# Altium project ft232h.PrjPcb
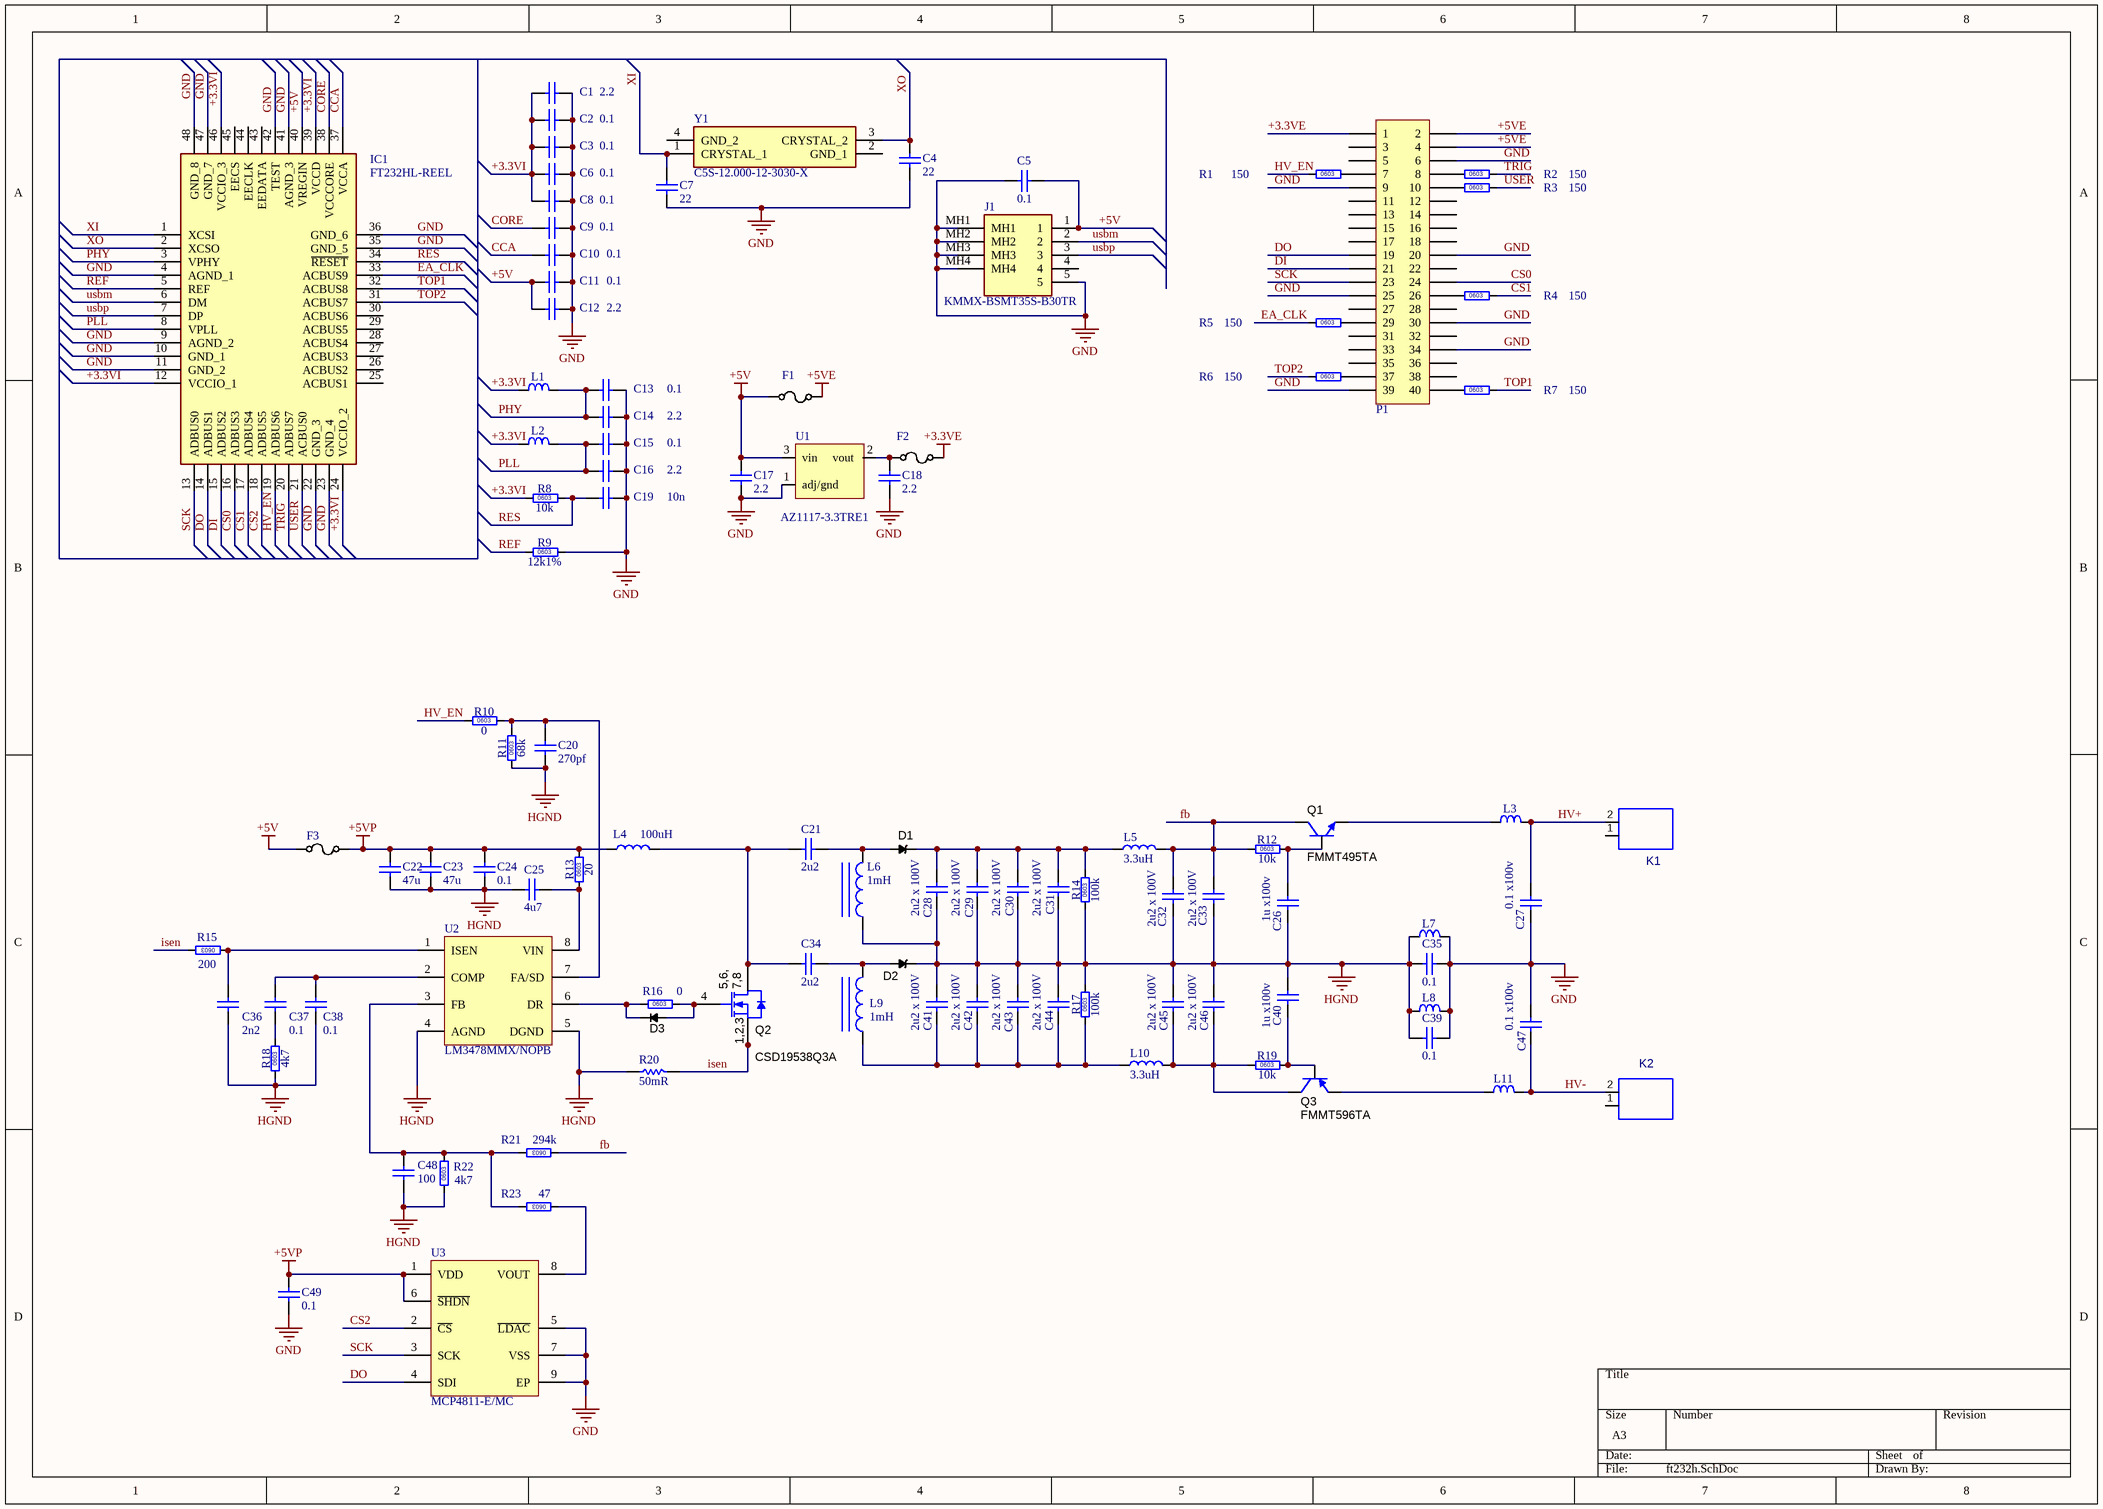
[diagram p0: ft232h.SchDoc]
1 sheet, 101 parts. Net scope: global (net labels, ports and power ports of the same name join across sheets).
Board file: ft232h.PcbDoc

## Sheet ft232h.SchDoc
size A3

### Parts
C1  value 2.2  [SM0603 _3D_cap]  (hidden comment: cap0603)
C2  value 0.1  [SM0603 _3D_cap]  (hidden comment: cap0603)
C3  value 0.1  [SM0603 _3D_cap]  (hidden comment: cap0603)
C4  value 22  [SM0603 _3D_cap]  (hidden comment: cap0603)
C5  value 0.1  [SM0603 _3D_cap]  (hidden comment: cap0603)
C6  value 0.1  [SM0603 _3D_cap]  (hidden comment: cap0603)
C7  value 22  [SM0603 _3D_cap]  (hidden comment: cap0603)
C8  value 0.1  [SM0603 _3D_cap]  (hidden comment: cap0603)
C9  value 0.1  [SM0603 _3D_cap]  (hidden comment: cap0603)
C10  value 0.1  [SM0603 _3D_cap]  (hidden comment: cap0603)
C11  value 0.1  [SM0603 _3D_cap]  (hidden comment: cap0603)
C12  value 2.2  [SM0603 _3D_cap]  (hidden comment: cap0603)
C13  value 0.1  [SM0603 _3D_cap]  (hidden comment: cap0603)
C14  value 2.2  [SM0603 _3D_cap]  (hidden comment: cap0603)
C15  value 0.1  [SM0603 _3D_cap]  (hidden comment: cap0603)
C16  value 2.2  [SM0603 _3D_cap]  (hidden comment: cap0603)
C17  value 2.2  [SM0603 _3D_cap]  (hidden comment: cap0603)
C18  value 2.2  [SM0603 _3D_cap]  (hidden comment: cap0603)
C19  value 10n  [SM0603 _3D_cap]  (hidden comment: cap0603)
C20  value 270pf  [SM0603 _3D_cap]  (hidden comment: cap0603)
C21  value 2u2  [SM0603 _3D_cap]  (hidden comment: cap0603)
C22  value 47u  [SM0805]  (hidden comment: cap0805)
C23  value 47u  [SM0805]  (hidden comment: cap0805)
C24  value 0.1  [SM0603 _3D_cap]  (hidden comment: cap0603)
C25  value 4u7  [SM0603 _3D_cap]  (hidden comment: cap0603)
C26  value 1u x100v  [SM0603 _3D_cap]  (hidden comment: cap0603)
C27  value 0.1 x100v  [SM0603 _3D_cap]  (hidden comment: cap0603)
C28  value 2u2 x 100V  [SM1206]  (hidden comment: cap1206)
C29  value 2u2 x 100V  [SM1206]  (hidden comment: cap1206)
C30  value 2u2 x 100V  [SM1206]  (hidden comment: cap1206)
C31  value 2u2 x 100V  [SM1206]  (hidden comment: cap1206)
C32  value 2u2 x 100V  [SM1206]  (hidden comment: cap1206)
C33  value 2u2 x 100V  [SM1206]  (hidden comment: cap1206)
C34  value 2u2  [SM0603 _3D_cap]  (hidden comment: cap0603)
C35  value 0.1  [SM0603 _3D_cap]  (hidden comment: cap0603)
C36  value 2n2  [SM0603 _3D_cap]  (hidden comment: cap0603)
C37  value 0.1  [SM0603 _3D_cap]  (hidden comment: cap0603)
C38  value 0.1  [SM0603 _3D_cap]  (hidden comment: cap0603)
C39  value 0.1  [SM0603 _3D_cap]  (hidden comment: cap0603)
C40  value 1u x100v  [SM0603 _3D_cap]  (hidden comment: cap0603)
C41  value 2u2 x 100V  [SM1206]  (hidden comment: cap1206)
C42  value 2u2 x 100V  [SM1206]  (hidden comment: cap1206)
C43  value 2u2 x 100V  [SM1206]  (hidden comment: cap1206)
C44  value 2u2 x 100V  [SM1206]  (hidden comment: cap1206)
C45  value 2u2 x 100V  [SM1206]  (hidden comment: cap1206)
C46  value 2u2 x 100V  [SM1206]  (hidden comment: cap1206)
C47  value 0.1 x100v  [SM0603 _3D_cap]  (hidden comment: cap0603)
C48  value 100  [SM0603 _3D_cap]  (hidden comment: cap0603)
C49  value 0.1  [SM0603 _3D_cap]  (hidden comment: cap0603)
D1  STPS1150A  [SMA]  (value not drawn)
D2  STPS1150A  [SMA]  (value not drawn)
D3  1N4148X-TP  [SOD-523]  (value not drawn)
F1  Fuse_0805  [MF-PSMF050X-2]  (value not drawn)
F2  Fuse_0805  [MF-PSMF050X-2]  (value not drawn)
F3  Fuse_0805  [MF-PSMF050X-2]  (value not drawn)
IC1  FT232HL-REEL  [QFP50P900X900X160-48N]
J1  KMMX-BSMT35S-B30TR  [KMMXBSMT35SB30TR]
K1  1x2PLS  [JUMPER2]  (value not drawn)
K2  1x2PLS  [JUMPER2]  (value not drawn)
L1  75R@100MHz  [SM0603_3D_res]  (value not drawn)
L2  75R@100MHz  [SM0603_3D_res]  (value not drawn)
L3  75R@100MHz  [SM0603_3D_res]  (value not drawn)
L4  100uH  [WE-LQS_8040]
L5  3.3uH  [WE 74479775233]
L6  1mH  [WE-TPC_4828]
L7  75R@100MHz  [SM0603_3D_res]  (value not drawn)
L8  75R@100MHz  [SM0603_3D_res]  (value not drawn)
L9  1mH  [WE-TPC_4828]
L10  3.3uH  [WE 74479775233]
L11  75R@100MHz  [SM0603_3D_res]  (value not drawn)
P1  2x20 2.54mm vertical  [PLD-40]  (value not drawn)
Q1  FMMT495TA  [SOT-23-3]
Q2  CSD19538Q3A  [DNH0008A]
Q3  FMMT596TA  [SOT-23-3]
R1  150  [SM0603_3D_res]
R2  150  [SM0603_3D_res]
R3  150  [SM0603_3D_res]
R4  150  [SM0603_3D_res]
R5  150  [SM0603_3D_res]
R6  150  [SM0603_3D_res]
R7  150  [SM0603_3D_res]
R8  10k  [SM0603_3D_res]
R9  12k1%  [SM0603_3D_res]
R10  0  [SM0603_3D_res]
R11  68k  [SM0603_3D_res]
R12  10k  [SM0603_3D_res]
R13  20  [SM0603_3D_res]
R14  100k  [SM0603_3D_res]
R15  200  [SM0603_3D_res]
R16  0  [SM0603_3D_res]
R17  100k  [SM0603_3D_res]
R18  4k7  [SM0603_3D_res]
R19  10k  [SM0603_3D_res]
R20  50mR  [RES 2010/5025]
R21  294k  [SM0603_3D_res]
R22  4k7  [SM0603_3D_res]
R23  47  [SM0603_3D_res]
U1  ldo  [SOT89-150P409X160-3N]  (value not drawn)
U2  LM3478MMX/NOPB  [MSOP8]
U3  MCP4811-E/MC  [DFN-8]
Y1  C5S-12.000-12-3030-X  [C5S]

### Nets
+3.3VE: F2.2 P1.1
+5V: C5.1 C11.2 C12.2 C17.2 F1.1 F3.1 IC1.40(VREGIN) J1.1 U1.3(vin)
+5VE: F1.2 P1.2 P1.4
+5VP: C22.2 C23.2 C24.2 C49.1 F3.2 L4.1 R13.2 U3.1(VDD) U3.6(~{SHDN})
GND: C1.1 C2.1 C3.1 C4.1 C5.2 C6.1 C7.1 C8.1 C9.1 C10.1 C11.1 C12.1 C13.1 C14.1 C15.1 C16.1 C17.1 C18.1 C19.1 C27.1 C35.2 C39.2 C47.2 C49.2 IC1.4(AGND_1) IC1.9(AGND_2) IC1.10(GND_1) IC1.11(GND_2) IC1.22(GND_3) IC1.23(GND_4) IC1.35(GND_5) IC1.36(GND_6) IC1.41(AGND_3) IC1.42(TEST) IC1.47(GND_7) IC1.48(GND_8) J1.5 J1.MH1 J1.MH2 J1.MH3 J1.MH4 L7.2 L8.2 P1.6 P1.9 P1.20 P1.25 P1.30 P1.34 P1.39 R9.2 U1.1(adj/gnd) U3.5(~{LDAC}) U3.7(VSS) U3.9(EP)
HGND: C20.2 C22.1 C23.1 C24.1 C25.1 C26.1 C28.1 C29.1 C30.1 C31.1 C32.1 C33.1 C35.1 C36.2 C38.2 C39.1 C40.2 C41.2 C42.2 C43.2 C44.2 C45.2 C46.2 C48.2 D2.1(K) L6.1 L7.1 L8.1 R11.1 R14.1 R17.2 R18.1 R20.1 R22.1 U2.4(AGND) U2.5(DGND)
+3.3VI: C1.2 C2.2 C3.2 C6.2 C8.2 IC1.12(VCCIO_1) IC1.24(VCCIO_2) IC1.39(VCCD) IC1.46(VCCIO_3) L1.1 L2.1 R8.1
CCA: C10.2 IC1.37(VCCA)
CORE: C9.2 IC1.38(VCCCORE)
CS0: IC1.16(ADBUS3) P1.24
CS1: IC1.17(ADBUS4) R4.2
CS2: IC1.18(ADBUS5) U3.2(~{CS})
DI: IC1.15(ADBUS2) P1.21
DO: IC1.14(ADBUS1) P1.19 U3.4(SDI)
EA_CLK: IC1.33(ACBUS9) R5.1
fb: C32.2 C33.2 L5.2 Q1.3(C) R12.1 R21.1
HV+: C27.2 K1.2 L3.2
HV-: C47.1 K2.2 L11.2
HV_EN: IC1.19(ADBUS6) R1.1 R10.1
isen: Q2.1(S) Q2.2(S) Q2.3(S) R15.2 R20.2
PHY: C13.2 C14.2 IC1.3(VPHY) L1.2
PLL: C15.2 C16.2 IC1.8(VPLL) L2.2
REF: IC1.5(REF) R9.1
RES: C19.2 IC1.34(~{RESET}) R8.2
SCK: IC1.13(ADBUS0) P1.23 U3.3(SCK)
TOP1: IC1.32(ACBUS8) R7.2
TOP2: IC1.31(ACBUS7) R6.1
TRIG: IC1.20(ADBUS7) R2.2
usbm: IC1.6(DM) J1.2
usbp: IC1.7(DP) J1.3
USER: IC1.21(ACBUS0) R3.2
XI: C7.2 IC1.1(XCSI) Y1.1(CRYSTAL_1)
XO: C4.2 IC1.2(XCSO) Y1.3(CRYSTAL_2)
NetC18_2: C18.2 F2.1 U1.2(vout)
NetC20_1: C20.1 R10.2 R11.2 U2.7(FA/SD)
NetC21_1: C21.1 C34.1 L4.2 Q2.5(D) Q2.6(D) Q2.7(D) Q2.8(D) Q2.9(D)
NetC21_2: C21.2 D1.2(A) L6.2
NetC25_2: C25.2 R13.1 U2.8(VIN)
NetC26_2: C26.2 Q1.1(B) R12.2
NetC28_2: C28.2 C29.2 C30.2 C31.2 D1.1(K) L5.1 R14.2
NetC34_2: C34.2 D2.2(A) L9.2
NetC36_1: C36.1 R15.1 U2.1(ISEN)
NetC37_1: C37.1 C38.1 U2.2(COMP)
NetC37_2: C37.2 R18.2
NetC40_1: C40.1 Q3.1(B) R19.2
NetC41_1: C41.1 C42.1 C43.1 C44.1 L9.1 L10.1 R17.1
NetC45_1: C45.1 C46.1 L10.2 Q3.3(C) R19.1
NetC48_1: C48.1 R21.2 R22.2 R23.2 U2.3(FB)
NetD3_1: D3.1(K) R16.1 U2.6(DR)
NetD3_2: D3.2(A) Q2.4(G) R16.2
NetL3_1: L3.1 Q1.2(E)
NetL11_1: L11.1 Q3.2(E)
NetP1_7: P1.7 R1.2
NetP1_8: P1.8 R2.1
NetP1_10: P1.10 R3.1
NetP1_26: P1.26 R4.1
NetP1_29: P1.29 R5.2
NetP1_37: P1.37 R6.2
NetP1_40: P1.40 R7.1
NetR23_1: R23.1 U3.8(VOUT)

Not connected (* = marked no-connect by the designer): IC1 25(ACBUS1) 26(ACBUS2) 27(ACBUS3) 28(ACBUS4) 29(ACBUS5) 30(ACBUS6) 43(EEDATA) 44(EECLK) 45(EECS); J1 4; K1 1; K2 1; P1 3 5 11 12 13 14 15 16 17 18 22 27 28 31 32 33 35 36 38; Y1 2(GND_1) 4(GND_2)

### Notes on the sheet
- (in symbol CSD19538Q3A) 5,6,; 7,8; 1,2,3
- (in symbol LM1117-XX-SOT89-3) AZ1117-3.3TRE1
- (in symbol Res_0603_EU) 0603

### Library data of the parts
C1-C21 C24-C27 C34-C40 C47-C49 = cap0603: Capacitor  0603 inch; Published: 8-Jun-2000; LatestRevisionDate: 17-Jul-2002; LatestRevisionNote: Re-released for DXP Platform.; PackageReference: RAD-0.3; Publisher: Altium Limited; PackageDescription: Radial Cap, Thru-Hole; 2 Leads; 0.3 in Pin Spacing
C22 C23 = cap0805: Capacitor; Published: 8-Jun-2000; LatestRevisionDate: 17-Jul-2002; LatestRevisionNote: Re-released for DXP Platform.; PackageReference: RAD-0.3; Publisher: Altium Limited; PackageDescription: Radial Cap, Thru-Hole; 2 Leads; 0.3 in Pin Spacing
C28-C33 C41-C46 = cap1206: Capacitor; Published: 8-Jun-2000; LatestRevisionDate: 17-Jul-2002; LatestRevisionNote: Re-released for DXP Platform.; PackageReference: RAD-0.3; Publisher: Altium Limited; PackageDescription: Radial Cap, Thru-Hole; 2 Leads; 0.3 in Pin Spacing
D1 D2 = STPS1150A: DIODE SCHOTTKY 150V 1A SMA; Manufacturer: STMicroelectronics; U/M: EA; Vf_V: 0.78; Value2: 0.78V; Io_A: 1; Vr_V: 150; TJmax_C: 175; RJC_CperW: 30; SizeAreaWB_mm2: 37.3428; SizeArea_mm2: 16.3228; SizeX_mm: 5.59; SizeY_mm: 2.92; SizeZ_mm: 2.87; AEC Category: Q101; AEC Qualified: N; Green_Lifecycle: Not Set; Green_REACh: Incomplete; CompType: Diode; SymbolVersion: 2008-12-08; PartNumber: STPS1150A; PackageReference: SMA; Value: 150V; Value1: 1A; MountType: SMT; Type: Schottky; RoHS: Y; Published: 2008-06-26; Publisher: Texas Instruments; LatestRevisionDate: 2017-06-26; ComponentLink1Description: Datasheet link; ComponentLink1URL: http://www.st.com/web/en/resource/technical/document/datasheet/CD00003321.pdf; Supplier 1: Digi-Key; Supplier Part Number 1: 497-7545-1-ND; Supplier 2: Newark; Supplier Part Number 2: 57P1608; Supplier 3: Mouser; Supplier Part Number 3: 511-STPS1150A; Green_EU RoHS: Incomplete; Green_EU RoHS-2: Incomplete
D3 = 1N4148X-TP: DIODE SWITCHING 75V 0.3A SOD-523; Manufacturer: Micro Commercial Components; U/M: EA; Vf_V: 1.25; Value2: 1.25V; Io_A: 0.3; Vr_V: 75; TJmax_C: 150; SizeAreaWB_mm2: 5.13; SizeArea_mm2: 1.53; SizeX_mm: 1.7; SizeY_mm: 0.9; SizeZ_mm: 0.65; AEC Category: Q101; Green_Lifecycle: Not Set; Green_REACh: Incomplete; SymbolVersion: 2008-12-08; PartNumber: 1N4148X-TP; PackageReference: SOD-523; CompType: Diode; Value: 75V; Value1: 0.3A; MountType: SMT; Type: Switching; RoHS: Y; Published: 2008-06-26; Publisher: Texas Instruments; LatestRevisionDate: 2017-06-26; ComponentLink1Description: Datasheet link; ComponentLink1URL: http://www.mccsemi.com/up_pdf/1N4148X(SOD-523).PDF; Supplier 1: Digi-Key; Supplier Part Number 1: 1N4148XTPMSCT-ND; Supplier 2: Newark; Supplier Part Number 2: 69R6666; Supplier 3: Mouser; Supplier Part Number 3: 833-1N4148X-TP; AEC Qualified: ?; Green_EU RoHS: Incomplete; Green_EU RoHS-2: Incomplete
F1-F3 = Fuse_0805: FUSE 0805 RESETTABLE PTC 6V 500MA; Manufacturer: BOURNS; Thermistor Mounting: SMD; Product Range: MF-PSMF Series; Holding Current: 500; Tripping Current: 1; Voltage Rating: 6; SVHC: No SVHC (20-Jun-2016); Carrying Current Max: 40; Current Temperature: 20; External Depth: 1.35; External Length / Height: 0.65; External Width: 2.15; Holding Current Max Ih: 0.5; Initial Resistance Max: 0.9; Initial Resistance Min: 0.15; PTC Fuse Case Style: 0805 [2012 Metric]; Thermistor Type: PTC Resettable Fuse; Trip Time: 0.1; Supplier 1: Farnell; Manufacturer Part Number: MF-PSMF050X-2; RoHS: YES; Stock 1: 28; Pricing 1: 5=0.229, 50=0.205, 250=0.173, 500=0.137, 1500=0.136, 3000=0.134, 15000=0.133 (GBP); Operating Temperature Min: -40; Operating Temperature Max: 85; Automotive Qualification Standard: -; Current Max: 40; Operating Voltage: 6; Packaging: Cut Tape; Resistance @ Temperature: 0.15; Resistance Temperature: 20; Termination Type: Surface Mount Device; ComponentLink1URL: http://www.bourns.com/engineering/mfpsmf/mf-psmf050x.stp; ComponentLink1Description: http://www.bourns.com/engineering/mfpsmf/mf-psmf050x.stp; ComponentLink2URL: http://www.youtube.com/embed/MCSq9aHzU7o; ComponentLink2Description: http://www.youtube.com/embed/MCSq9aHzU7o; ComponentLink3URL: http://www.farnell.com/datasheets/2041417.pdf; ComponentLink3Description: http://www.farnell.com/datasheets/2041417.pdf
IC1 = FT232HL-REEL: Integrated Circuit; Manufacturer_Name: FTDI Chip; Datasheet Link: http://www.ftdichip.com/Support/Documents/DataSheets/ICs/DS_FT232H.pdf; Height: 1.6mm; Manufacturer_Part_Number: FT232HL-REEL; Mouser Part Number: 895-FT232HL-REEL; Mouser Price/Stock: https://www.mouser.co.uk/ProductDetail/FTDI/FT232HL-REEL/?qs=rzPzygjq8vIanTFlYsBQCw%3D%3D; Arrow Part Number: FT232HL-REEL; Arrow Price/Stock: https://www.arrow.com/en/products/ft232hl-reel/ftdi-chip
J1 = KMMX-BSMT35S-B30TR: Connector; Manufacturer_Name: Kycon; Datasheet Link: http://www.kycon.com/Pub_Eng_Draw/KMMX-BSMT35S-BTR.pdf; Height: 2.18mm; Manufacturer_Part_Number: KMMX-BSMT35S-B30TR
L1-L3 L7 L8 L11 = chip inductance 0603: Part Number: IND0805_MURATA_BLM21BB750SN1D; Part Description: SMD EMIFIL Suppression Chip Ferrite Bead; Manufacturer: MURATA; Manufacturer Part Number: BLM21BB750SN1D; Power: 700mA; Resistance: 0.16R; Tolerance: ±25%; Table: Inductors SMD; Component Kind: Standard; Component Type: Standard; Footprint: INDC2012X105N; Pin Count: 2; Value: 75R@100MHz; Status: None; Case: 0805; Mounted: Yes; Socket: No; SMD: Yes; ComponentHeight: 1.05mm; Author: S. Jafar; CreateDate: 12/21/2015; LatestRevisionDate: 12/21/2015
L4 = inductance_8040: INDUCTOR 100uH 8040 1A 290mOhm; Manufacturer: Wurth Electronics; Manufacturer Part Number: 74404084101; Core Material: Ferrite; Inductance Tolerance: 20%; Current Rating: 1.2A; Saturation Current: 1.5A; Shielding: Shielded; DC Resistance (DCR): 290mR; Self Resonant Frequency: 6.4MHz; Test Frequency: 100kHz; Supplier 1: Farnell; Stock 1: 0; Pricing 1: 10=1.38, 50=0.922, 100=0.891, 250=0.859, 500=0.746, 1000=0.633, 5000=0.62 (EUR); Mount: Surface Mount; Case/Package: Nonstandard; Min Operating Temperature: -40°C; Max Operating Temperature: 125°C; Packaging: Tape and Reel; Resistor Type: Wirewound; Inductance: 100uH; RMS Current (Irms): 1A; Tolerance: 20%; Termination: SMD/SMT; Max DC Current: 1A; Package Quantity: 1000; Length: 0.315inch; Width: 0.315inch; Height: 4.2mm; Height - Seated (Max): 0.165inch; REACH SVHC: Unknown; RoHS Compliant: Yes; ComponentLink1URL: http://www.farnell.com/datasheets/1832943.pdf?src-supplier=Element14; ComponentLink1Description: http://www.farnell.com/datasheets/1832943.pdf?src-supplier=Element14
L5 L10 = Inductor_0805: INDUCTOR 3.3uH 0805 ±20%  1A; Manufacturer: Wurth Electronics; Manufacturer Part Number: 74479775233; Saturation Current: 280mA; Shielding: Unshielded; DC Resistance (DCR): 200mR; Self Resonant Frequency: 30MHz; Test Frequency: 1MHz; Supplier 1: Farnell; Stock 1: 0; Pricing 1: 10=0.739, 50=0.517, 250=0.446, 500=0.41, 1500=0.404, 3000=0.398, 15000=0.39 (EUR); Mount: Surface Mount; Case/Package: SMD/SMT; Case Code (Metric): 2012; Case Code (Imperial): 0805; Min Operating Temperature: -40°C; Max Operating Temperature: 125°C; Packaging: Tape and Reel; Inductance: 3.3uH; Current Rating: 1A; Tolerance: 20%; Length: 0.079inch; Width: 0.047inch; Height - Seated (Max): 0.039inch; RoHS Compliant: Yes
L6 L9 = inductor_4828: INDUCTOR 1mH ±30% 140mA; Manufacturer: Wurth Electronics; Manufacturer Part Number: 744043102; Supplier 1: RSComponents; Stock 1: 0; Pricing 1: 500=0.747 (EUR); RoHS Compliant: Yes; Inductance: 1mH
P1 = 2x20 2.54mm vertical: Header, 40-Pin; LatestRevisionDate: 17-Jul-2002; LatestRevisionNote: Re-released for DXP Platform.; Publisher: Altium Limited
Q1 = FMMT495TA: TRANSISTOR NPN 150V 1A AEC-Q101 SOT-23; Manufacturer: Diodes Inc.; TaMin_C: -55°C; HfeMax: 300.0; SizeAreaWB_mm2: 14.0; U/M: EA; TaMax_C: 150°C; SizeZ_mm: 1.1; SizeX_mm: 2.5; SizeY_mm: 3.0; SizeArea_mm2: 7.5; CompType: BJT; PNP: 0.0; AEC Qualified: Y; NPN: 1.0; Vcesat1_V: 3dV; AEC Category: Q101; ComponentLink1URL: https://www.diodes.com/assets/Datasheets/FMMT495.pdf; Supplier Part Number 2: 522-FMMT495TA; Publisher: Texas Instruments; Supplier 2: Mouser; Published: 2008-07-31; RoHS: Y; Value1: 1 A; MountType: SMT; Vceo_V: 150V; Value: 150 V; Supplier 1: Digi-Key; IcRated_A: 1A; PackageReference: SOT-23; Value2: 300.0; PartNumber: FMMT495TA; LatestRevisionDate: 2017-06-26; ComponentLink1Description: Datasheet link; Supplier Part Number 1: FMMT495CT-ND
Q2 = CSD19538Q3A: MOSFET N 100V 5A; Alternate Manufacturer: None; Manufacturer: Texas Instruments; SizeZ_mm: 0.9; Value2: 7.2 nC; SizeX_mm: 3.3; SizeAreaWB_mm2: 18.49; Vgs_V: 20V; QgTyp_nC: 7.2; SizeArea_mm2: 10.89; AEC Category: Q101; ChMode: Enhancement; ChType: N; PartNumber: CSD19538Q3A; ComponentLink1Description: Datasheet link; VdsMax_V: 100V; SizeY_mm: 3.3; CompType: MOSFET; AEC Qualified: N; Value: 100V; RoHS: Y; IdsMax_A: 5A; PackageReference: DNH0008A; MountType: SMT; ComponentLink1URL: http://www.ti.com/lit/ds/symlink/csd19538q3a.pdf
Q3 = FMMT596TA: TRANSISTOR PNP 200V 0.3A SOT-23; Manufacturer: Diodes Inc.; TaMax_C: 150°C; Value2: 300; Vcesat1_V: 2dV; SizeX_mm: 2.5; SizeY_mm: 3; TaMin_C: -55°C; IcRated_A: 3dA; CompType: BJT; SizeZ_mm: 1.1; AEC Qualified: N; SizeArea_mm2: 7.5; NPN: 0; PNP: 1; AEC Category: Q101; SizeAreaWB_mm2: 14; U/M: EA; Supplier 2: Mouser; Supplier 1: Digi-Key; Supplier Part Number 1: FMMT596CT-ND; Supplier Part Number 2: 522-FMMT596TA; Value1: 0.3 A; PartNumber: FMMT596TA; LatestRevisionDate: 2017-03-09; Publisher: Texas Instruments; ComponentLink1Description: Datasheet link; HfeMax: 300; Value: 200 V; Published: 2008-07-31; RoHS: Y; Vceo_V: 200V; PackageReference: SOT-23; MountType: SMT; ComponentLink1URL: http://www.diodes.com/_files/datasheets/FMMT596.pdf
R1-R17 R19 R21 R23 = Res_0603_EU: Part Number: R1206_4K7_1%_0.25W_100PPM; Part Description: General Purpose Thick Film Chip Resistor; Manufacturer: GENERIC; Manufacturer1 Part Number: NRC12F4701TRF; Value: 4k7; Power: 0.25W; TC: ±100ppm/°C; Tolerance: ±1%; Table: Resistors SMD; Component Kind: Standard; Component Type: Standard; Footprint: RESC3216X65N; Pin Count: 2; Status: Preferred; Manufacturer Part Number: R1206_4K7_1%_0.25W_100PPM; Case: 1206; Mounted: Yes; Socket: No; SMD: Yes; Manufacturer1 Example: NIC COMPONENT; Manufacturer1 ComponentHeight: 0.65mm; HelpURL: \\cern.ch\dfs\Applications\Altium\Datasheets\R1206_NIC_NRC.pdf; Author: CERN DEM JLC; CreateDate: 12/3/2007; LatestRevisionDate: 3/13/2008
R18 R22 = Res_0603_EU: Part Number: R1206_4K7_1%_0.25W_100PPM; Part Description: General Purpose Thick Film Chip Resistor; Manufacturer: GENERIC; Manufacturer1 Part Number: NRC12F4701TRF; Power: 0.25W; TC: ±100ppm/°C; Tolerance: ±1%; Table: Resistors SMD; Component Kind: Standard; Component Type: Standard; Footprint: RESC3216X65N; Pin Count: 2; Value: 4k7; Status: Preferred; Manufacturer Part Number: R1206_4K7_1%_0.25W_100PPM; Case: 1206; Mounted: Yes; Socket: No; SMD: Yes; Manufacturer1 Example: NIC COMPONENT; Manufacturer1 ComponentHeight: 0.65mm; HelpURL: \\cern.ch\dfs\Applications\Altium\Datasheets\R1206_NIC_NRC.pdf; Author: CERN DEM JLC; CreateDate: 12/3/2007; LatestRevisionDate: 3/13/2008
R20 = Res_SMT_2010: RESISTOR 0.05R 2010 1%; Manufacturer: Panasonic; Manufacturer Part Number: ERJ-L1DKF50MU; Temperature Coefficient: 100ppm/°C; Power Rating: 500mW; Supplier 1: Farnell; Stock 1: 0; Mount: Surface Mount; Case/Package: 2010; Contact Plating: Tin; Case Code (Imperial): 2010; Case Code (Metric): 5025; Min Operating Temperature: -55°C; Max Operating Temperature: 125°C; Resistance: 50mR; Tolerance: 1%; Resistor Type: Thick Film; Packaging: Tape and Reel; Package Quantity: 1; Termination: SMD/SMT; Number of Terminations: 2; Max Power Dissipation: 500mW; Features: Automotive AEC-Q200; Technology: THICK FILM; Series: ERJ; Resistance Tolerance: 1%; Construction: Rectangular; Length: 5mm; Width: 2.5mm; Height: 0.028inch; Depth: 2.5mm; Radiation Hardening: No; REACH SVHC: No SVHC; Military Standard: Not; Lead Free: Lead Free; RoHS Compliant: Yes; ComponentLink1URL: http://www.farnell.com/datasheets/1790602.pdf?src-supplier=Element14; ComponentLink1Description: http://www.farnell.com/datasheets/1790602.pdf?src-supplier=Element14; ComponentLink2URL: https://industrial.panasonic.com/cdbs/www-data/pdf/RDN0000/AOA0000C313.pdf?src-supplier=Digi-Key; ComponentLink2Description: https://industrial.panasonic.com/cdbs/www-data/pdf/RDN0000/AOA0000C313.pdf?src-supplier=Digi-Key; ComponentLink3URL: http://industrial.panasonic.com/lecs/www-data/pdf/AOA0000/AOA0000CE3.pdf?src-supplier=Digi-Key; ComponentLink3Description: http://industrial.panasonic.com/lecs/www-data/pdf/AOA0000/AOA0000CE3.pdf?src-supplier=Digi-Key
U1 = LM1117-XX-SOT89-3: SOT89-3 ldo
U2 = LM3478MMX/NOPB: DC/DC Controller 2.97V to 40V Input; Manufacturer: TI National Semiconductor; Number of Outputs: 1; Output Voltage: 1.26V; Output Current: 1A; Switching Frequency: 1MHz; Max Duty Cycle: 100%; Quiescent Current: 2.7mA; Supplier 1: Farnell; Manufacturer Part Number: LM3478MMX/NOPB; Stock 1: 0; Mount: Surface Mount; Case/Package: MSOP; Number of Pins: 8; Contact Plating: Tin,Matte; Min Operating Temperature: -40°C; Max Operating Temperature: 125°C; Operating Supply Voltage: 40V; Packaging: Tape and Reel; Max Frequency: 1MHz; Duty Cycle: 100%; Radiation Hardening: No; Lead Free: Lead Free; ComponentLink1URL: http://www.ti.com/lit/ds/symlink/lm3478.pdf?src-supplier=Digi-Key; ComponentLink1Description: http://www.ti.com/lit/ds/symlink/lm3478.pdf?src-supplier=Digi-Key
U3 = MCP4811-E/MC: DAC 1-CH 10-bit DFN-8; Manufacturer: Microchip; Resolution: 10b; Integral Nonlinearity (INL): 3.5LSB; Output Type: Voltage; Interface: SPI,Serial,3-WIRE; Number of DAC Channels: 1; Nominal Supply Current: 330uA; Max Supply Voltage: 5.5V; Min Supply Voltage: 2.7V; Operating Supply Voltage: 5V; Settling Time: 4.5us; Number of Bits: 10; Polarity: Bipolar; Input Offset Voltage (Vos): 820uV; Supplier 1: Farnell; Manufacturer Part Number: MCP4811-E/MC; Stock 1: 0; Mount: Surface Mount; Case/Package: DFN; Number of Pins: 8; Min Operating Temperature: -40°C; Max Operating Temperature: 125°C; Packaging: Rail/Tube; Package Quantity: 150; Number of Channels: 1; Number of Converters: 1; Output Polarity: Bipolar; Supply Current: 330uA; Full Scale Error: 3.5LSB; Length: 2mm; Width: 3mm; Height: 0.95mm; Radiation Hardening: No; REACH SVHC: No SVHC; Lead Free: Lead Free; ComponentLink1URL: http://www.farnell.com/datasheets/630375.pdf?src-supplier=Element14; ComponentLink1Description: http://www.farnell.com/datasheets/630375.pdf?src-supplier=Element14; ComponentLink2URL: http://uk.rs-online.com/webdocs/1381/0900766b813810b8.pdf?src-supplier=RSComponents; ComponentLink2Description: http://uk.rs-online.com/webdocs/1381/0900766b813810b8.pdf?src-supplier=RSComponents; ComponentLink3URL: http://ww1.microchip.com/downloads/en/DeviceDoc/22244B.pdf?src-supplier=Avnet; ComponentLink3Description: http://ww1.microchip.com/downloads/en/DeviceDoc/22244B.pdf?src-supplier=Avnet; ComponentLink4URL: http://www.microchip.com/mymicrochip/filehandler.aspx?ddocname=en547908&src-supplier=Future+Electronics; ComponentLink4Description: http://www.microchip.com/mymicrochip/filehandler.aspx?ddocname=en547908&src-supplier=Future+Electronics; ComponentLink5URL: https://www.verical.com/server-webapp/html/getDatasheet?partID=765518&src-supplier=Verical; ComponentLink5Description: https://www.verical.com/server-webapp/html/getDatasheet?partID=765518&src-supplier=Verical; ComponentLink6URL: http://ww1.microchip.com/downloads/en/DeviceDoc/22244B.pdf?src-supplier=Avnet+Europe; ComponentLink6Description: http://ww1.microchip.com/downloads/en/DeviceDoc/22244B.pdf?src-supplier=Avnet+Europe; ComponentLink7URL: http://www.microchip.com/mymicrochip/filehandler.aspx?ddocname=en023833&src-supplier=Digi-Key; ComponentLink7Description: http://www.microchip.com/mymicrochip/filehandler.aspx?ddocname=en023833&src-supplier=Digi-Key; ComponentLink8URL: http://www.produktinfo.conrad.com/datenblaetter/1000000-1099999/001083268-da-01-en-DAC_10B_SPI_VREF_MCP4811_E_MC_DFN_8_MCP.pdf?src-supplier=Conrad; ComponentLink8Description: http://www.produktinfo.conrad.com/datenblaetter/1000000-1099999/001083268-da-01-en-DAC_10B_SPI_VREF_MCP4811_E_MC_DFN_8_MCP.pdf?src-supplier=Conrad
Y1 = C5S-12.000-12-3030-X: Crystal or Oscillator; Manufacturer_Name: AKER; Datasheet Link: https://docs-emea.rs-online.com/webdocs/1233/0900766b812338b8.pdf; Manufacturer_Part_Number: C5S-12.000-12-3030-X
K1 K2 = 1x2PLS: Value: *